# EAGLE design relay (EAGLE 9.2.2)
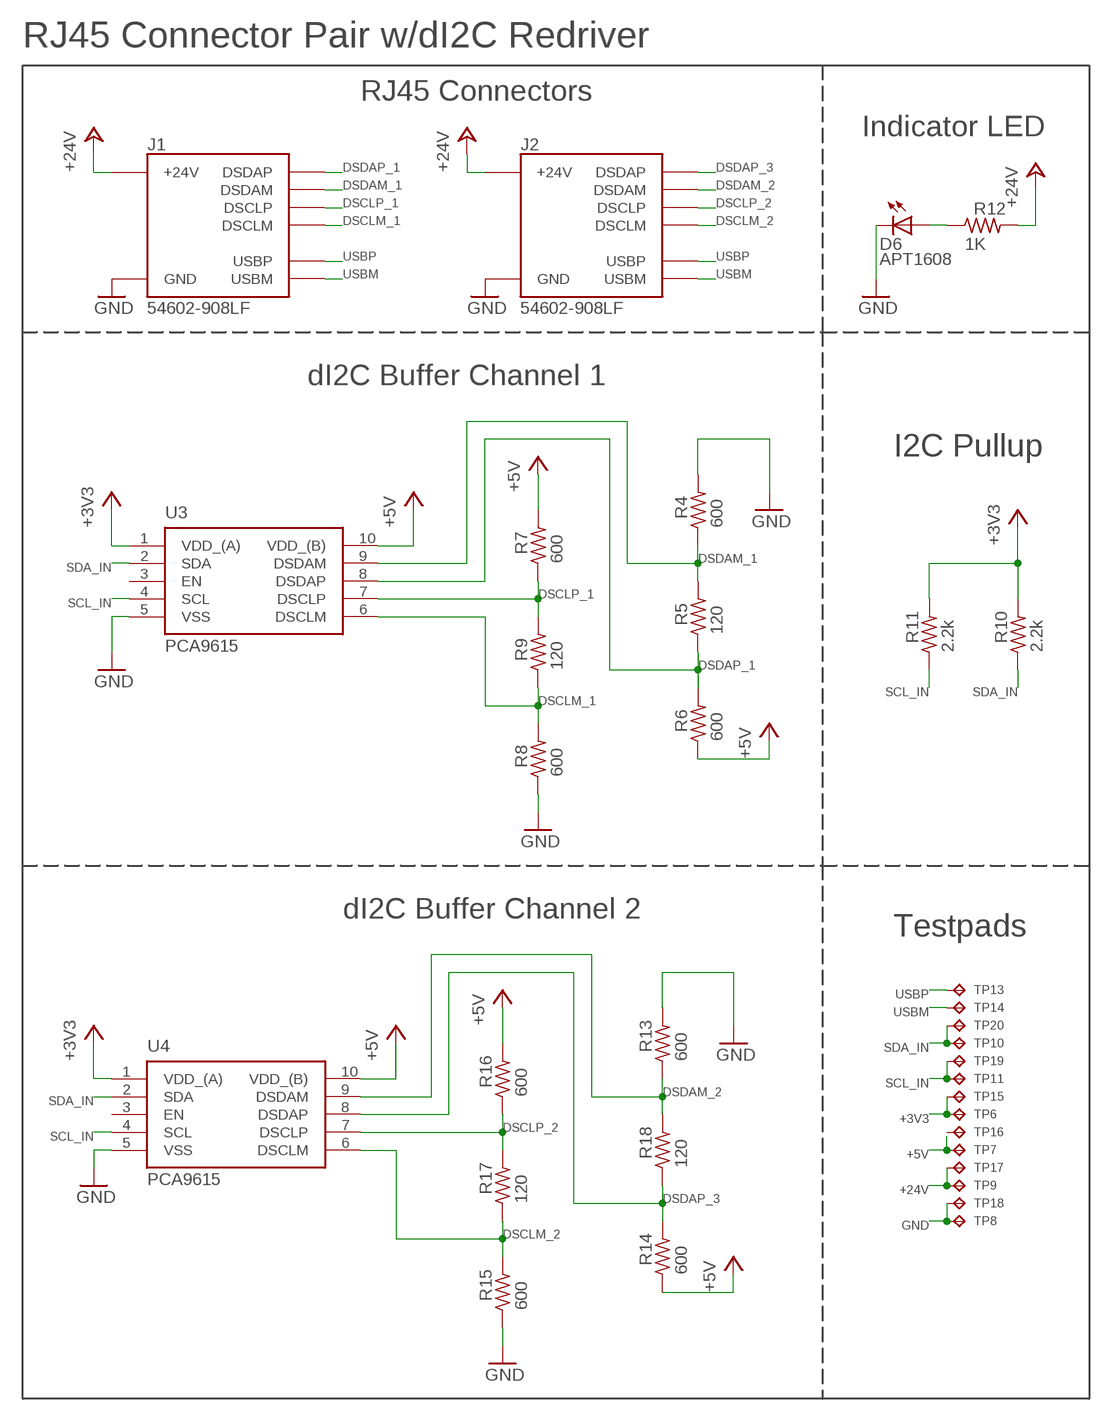
[diagram p0: schematic, sheet 1, part 1 of 2]
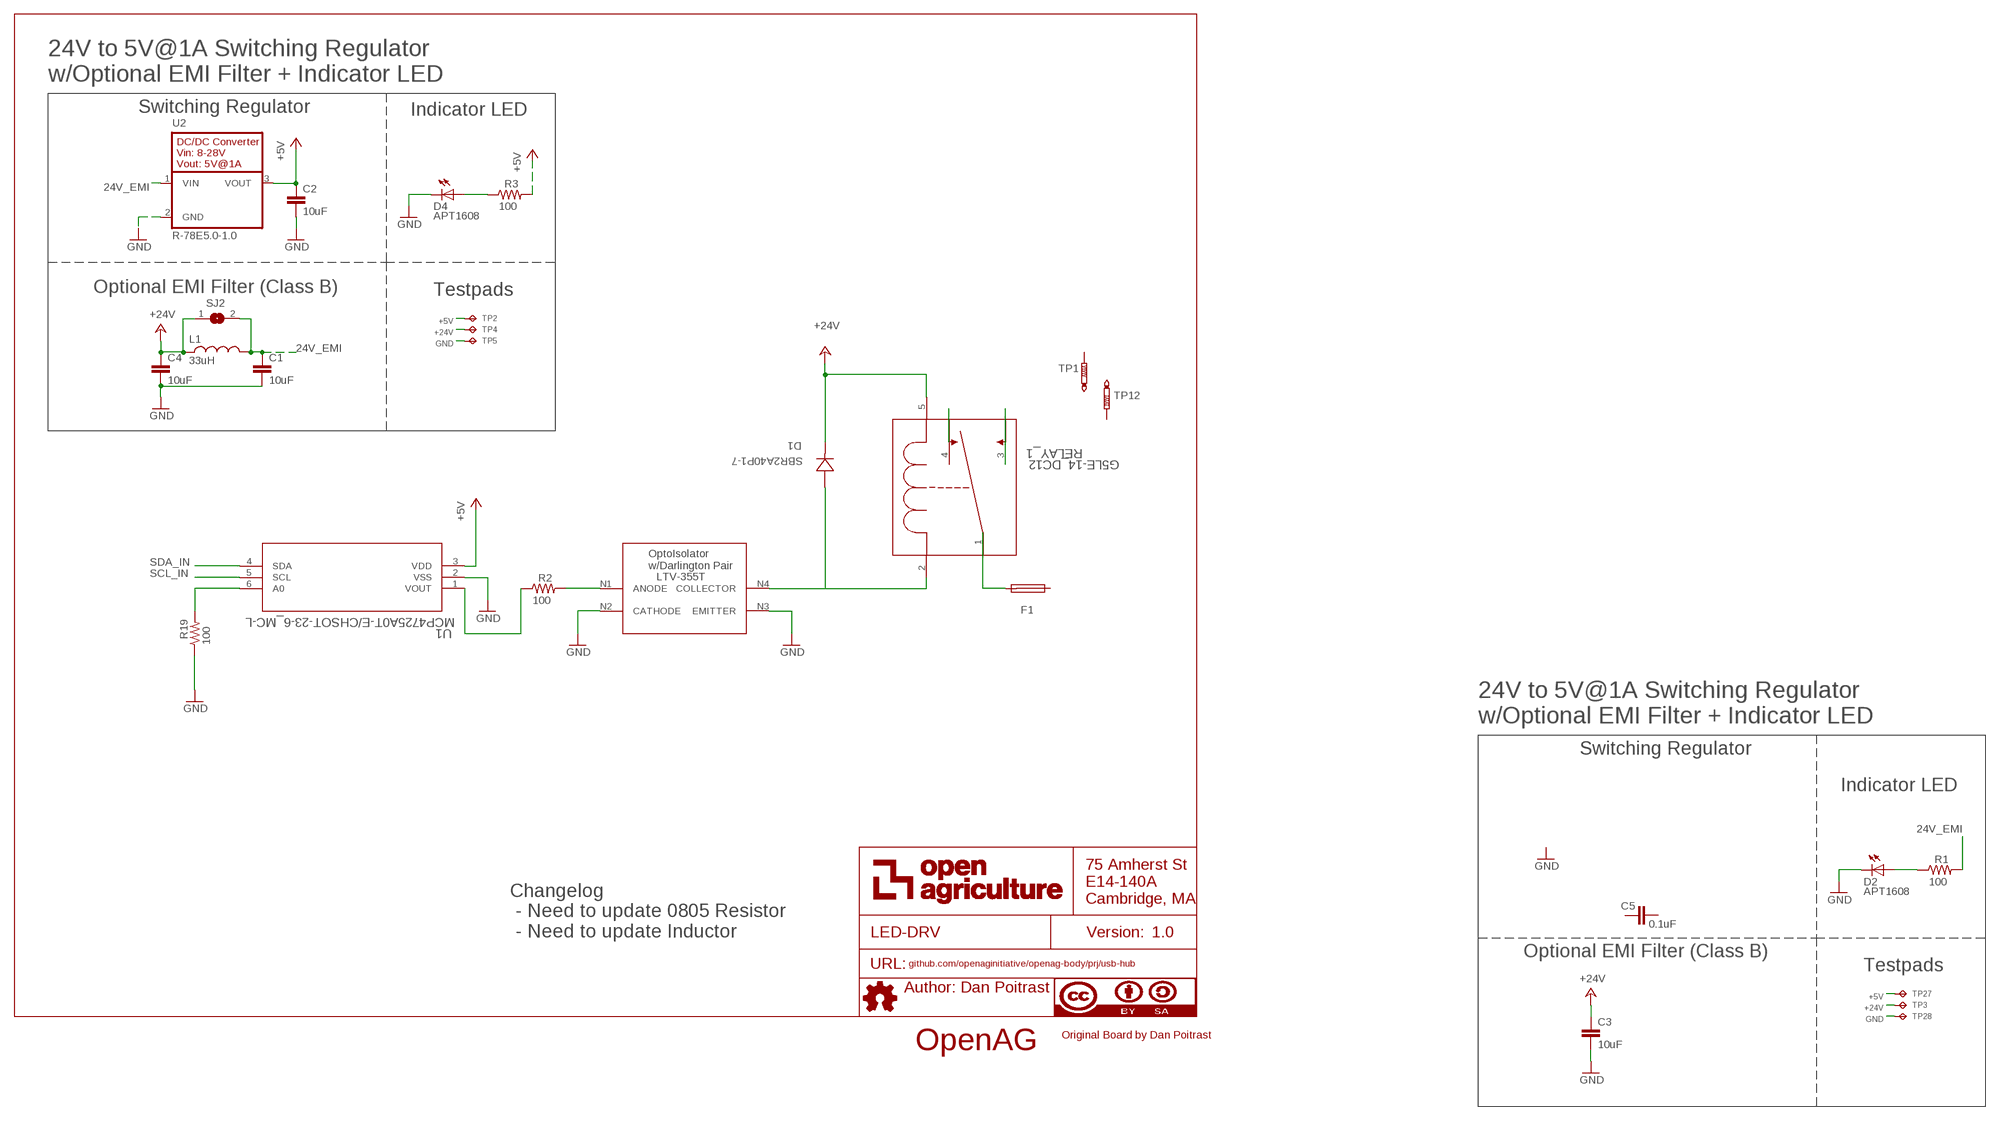
[diagram p1: schematic, sheet 1, part 2 of 2]

## Parts
C1  10uF  10UF-GMK212BBJ106KG-T  [C0805]
C2  10uF  10UF-GMK212BBJ106KG-T  [C0805]
C3  10uF  10UF-GMK212BBJ106KG-T  [C0805]
C4  10uF  10UF-GMK212BBJ106KG-T  [C0805]
C5  0.1uF  0.1UF-C0603C104K5RACTU  [C0603]
D1  SBR2A40P1-7  [POWERDI123]
D2  APT1608  APT1608CGCK  [CHIPLED_0603]
D4  APT1608  APT1608CGCK  [CHIPLED_0603]
D6  APT1608  APT1608CGCK  [CHIPLED_0603]
F1  GSH15  [GSH15]
J1  54602-908LF  RJ45-DI2C-USB-54602-908LFPTH  [RJ45-DI2C-USB-54602-908LF]
J2  54602-908LF  RJ45-DI2C-USB-54602-908LFPTH  [RJ45-DI2C-USB-54602-908LF]
L1  33uH  33UH-29333C  [29333C]
R1  100  100OHM-RC0603JR-07100RL  [RC0603N]
R2  100  100OHM-RC0603JR-07100RL  [RC0603N]
R3  100  100OHM-RC0603JR-07100RL  [RC0603N]
R4  600  600OHM-RC0603FR-07604RL  [RC0603N]
R5  120  120OHM-RC0603FR-07120RL  [RC0603N]
R6  600  600OHM-RC0603FR-07604RL  [RC0603N]
R7  600  600OHM-RC0603FR-07604RL  [RC0603N]
R8  600  600OHM-RC0603FR-07604RL  [RC0603N]
R9  120  120OHM-RC0603FR-07120RL  [RC0603N]
R10  2.2k  2.2K-RC0603JR-072K2L  [RC0603N]
R11  2.2k  2.2K-RC0603JR-072K2L  [RC0603N]
R12  1K  1K-ERJ-PB3D1001V  [RC0603N]
R13  600  600OHM-RC0603FR-07604RL  [RC0603N]
R14  600  600OHM-RC0603FR-07604RL  [RC0603N]
R15  600  600OHM-RC0603FR-07604RL  [RC0603N]
R16  600  600OHM-RC0603FR-07604RL  [RC0603N]
R17  120  120OHM-RC0603FR-07120RL  [RC0603N]
R18  120  120OHM-RC0603FR-07120RL  [RC0603N]
R19  100  100OHM-RC0603JR-07100RL  [RC0603N]
RELAY_1  G5LE-14_DC12  [RELAY_G5LE-1]
SJ2  EMI-BYPASS  [EMI-BYPASS]
TP1  PTR1B2,54  [B2,54]
TP2  TPTP06R  [TP06R]
TP3  TPTP06R  [TP06R]
TP4  TPTP06R  [TP06R]
TP5  TPTP06R  [TP06R]
TP6  TPTP04R  [TP04R]
TP7  TPTP04R  [TP04R]
TP8  TPTP04R  [TP04R]
TP9  TPTP04R  [TP04R]
TP10  TPTP04R  [TP04R]
TP11  TPTP04R  [TP04R]
TP12  PTR1B2,54  [B2,54]
TP13  TPTP04R  [TP04R]
TP14  TPTP04R  [TP04R]
TP15  TPTP04R  [TP04R]
TP16  TPTP04R  [TP04R]
TP17  TPTP04R  [TP04R]
TP18  TPTP04R  [TP04R]
TP19  TPTP04R  [TP04R]
TP20  TPTP04R  [TP04R]
TP27  TPTP06R  [TP06R]
TP28  TPTP06R  [TP06R]
U1  MCP4725A0T-E/CHSOT-23-6_MC-L  [SOT-23-6_MC-L]
U2  R-78E5.0-1.0  [R-78E5.0-1.0]
U3  PCA9615  PCA9615DPJ  [SOP50P490X110-10N]
U4  PCA9615  PCA9615DPJ  [SOP50P490X110-10N]
U$6  AUTHOR  [AUTHOR]
U$7  TITLE  [TITLE]
U$9  LTV-355T  [LTV-355T]

## Nets
24V_EMI: C1.1 L1.2 R1.2 SJ2.2 U2.1(VIN)
+3V3: R10.2 R11.2 TP6.1(TP) TP15.1(TP) U3.1(VDD_(A)) U4.1(VDD_(A))
+5V: C2.1 R3.2 R6.1 R7.2 R14.1 R16.2 TP2.TP TP7.1(TP) TP16.1(TP) TP27.TP U1.3(VDD) U2.3(VOUT) U3.10(VDD_(B)) U4.10(VDD_(B))
+24V: C3.1 C4.1 D1.- J1.24V(6)(+24V) J2.24V(6)(+24V) L1.1 R12.2 RELAY_1.5 SJ2.1 TP3.TP TP4.TP TP9.1(TP) TP17.1(TP)
DSCLM_1: J1.DSCLM(5)(DSCLM) R8.2 R9.1 U3.6(DSCLM)
DSCLM_2: J2.DSCLM(5)(DSCLM) R15.2 R17.1 U4.6(DSCLM)
DSCLP_1: J1.DSCLP(4)(DSCLP) R7.1 R9.2 U3.7(DSCLP)
DSCLP_2: J2.DSCLP(4)(DSCLP) R16.1 R17.2 U4.7(DSCLP)
DSDAM_1: J1.DSDAM(2)(DSDAM) R4.1 R5.2 U3.9(DSDAM)
DSDAM_2: J2.DSDAM(2)(DSDAM) R13.1 R18.2 U4.9(DSDAM)
DSDAP_1: J1.DSDAP(1)(DSDAP) R5.1 R6.2 U3.8(DSDAP)
DSDAP_3: J2.DSDAP(1)(DSDAP) R14.2 R18.1 U4.8(DSDAP)
GND: C1.2 C2.2 C3.2 C4.2 D2.C D4.C D6.C R4.2 R8.1 R13.2 R15.1 R19.1 TP5.TP TP8.1(TP) TP18.1(TP) TP28.TP U1.2(VSS) U2.2(GND) U3.5(VSS) U4.5(VSS) U$9.N2(CATHODE) U$9.N3(EMITTER)
N$4: RELAY_1.3
N$5: D1.+ RELAY_1.2 U$9.N4(COLLECTOR)
N$6: D2.A R1.1
N$11: F1.2 RELAY_1.1
N$27: R2.2 U$9.N1(ANODE)
N$31: R2.1 U1.1(VOUT)
N$32: R19.2 U1.6(A0)
N$33: D4.A R3.1
N$43: D6.A R12.1
SCL_IN: R11.1 TP11.1(TP) TP19.1(TP) U1.5(SCL) U3.4(SCL) U4.4(SCL)
SDA_IN: R10.1 TP10.1(TP) TP20.1(TP) U1.4(SDA) U3.2(SDA) U4.2(SDA)
USBM: J1.USBM(8)(USBM) J2.USBM(8)(USBM) TP14.1(TP)
USBP: J1.USBP(7)(USBP) J2.USBP(7)(USBP) TP13.1(TP)
Unconnected: C5.1 C5.2 F1.1 J1.GND(3)(GND) J2.GND(3)(GND) RELAY_1.4 TP1.TP TP12.TP U3.3(EN) U4.3(EN)

## Notes on the sheet
- 24V to 5V@1A Switching Regulator
  w/Optional EMI Filter + Indicator LED
- RJ45 Connector Pair w/dI2C Redriver
- Switching Regulator | Indicator LED
- RJ45 Connectors
- Indicator LED
- Optional EMI Filter (Class B) | Testpads
- dI2C Buffer Channel 1
- I2C Pullup
- LTV-355T
- dI2C Buffer Channel 2
- Testpads
- 24V to 5V@1A Switching Regulator
  w/Optional EMI Filter + Indicator LED
- Switching Regulator
- Indicator LED
- Changelog
   - Need to update 0805 Resistor
   - Need to update Inductor
- Optional EMI Filter (Class B)
- Testpads
- Original Board by Dan Poitrast
- OpenAG

## Library data of the parts
C1-C4 = openag-capacitors:10UF-GMK212BBJ106KG-T: CAP CER 10UF 35V X5R 0805 Description: 10µF ±10% 35V Ceramic Capacitor X5R 0805 (2012 Metric) Technical Specifications: Capacitance: 10µF Tolerance: ±10% Rated Voltage: 35V Temperature Coefficient: X5R Operating Temperature: -55°C ~ 85°C Package / Case: 0805 (2012 Metric) Datasheet(s): GMK212BBJ106KG-T Spec <http://ds.yuden.co.jp/TYCOMPAS/ut/detail.do?productNo=GMK212BBJ106KG-T&fileName=GMK212BBJ106KG-T_SS&mode=specSheetDownload> Vendor(s): Digikey: 587-4893-1-ND <https://www.digikey.com/product-detail/en/taiyo-yuden/GMK212BBJ106KG-T/587-4893-1-ND/6563736>; MANUFACTURER: Taiyo Yuden; MPN: GMK212BBJ106KG-T; VENDOR: Digikey; VLINK: https://www.digikey.com/product-detail/en/taiyo-yuden/GMK212BBJ106KG-T/587-4893-1-ND/6563736; VPN: 587-4893-1-ND
C5 = openag-capacitors:0.1UF-C0603C104K5RACTU: CAP CER 0.1UF 50V X7R 0603 Description: 0.1µF ±10% 50V Ceramic Capacitor X7R 0603 (1608 Metric) Technical Specifications: Capacitance: 0.1µF Tolerance: ±10% Rated Voltage: 50V Temperature Coefficient: X7R Operating Temperature: -55°C ~ 125°C Package / Case: 0603 (1608 Metric) Datasheet(s): X7R Dielectric, 6.3-250 VDC <https://search.kemet.com/component-edge/download/datasheet/C0603C104K5RACTU.pdf> Vendor(s): Digikey: 399-5089-1-ND <https://www.digikey.com/product-detail/en/kemet/C0603C104K5RACTU/399-5089-1-ND/1465623>; MANUFACTURER: Kemet; MPN: C0603C104K5RACTU; VENDOR: Digikey; VLINK: https://www.digikey.com/product-detail/en/kemet/C0603C104K5RACTU/399-5089-1-ND/1465623; VPN: 399-5089-1-ND
D1 = openag-diodes:SBR2A40P1-7: DIODE SBR 40V 2A POWERDI123 Description: Diode Super Barrier 40V 2A Surface Mount PowerDI™ 123 Technical Specifications: Diode Type: Super Barrier Voltage - DC Reverse (Vr) (Max): 40V Current - Average Rectified (Io): 2A Voltage - Forward (Vf) (Max) @ If: 500mV @ 2A Speed: Standard Recovery >500ns, > 200mA (Io) Current - Reverse Leakage @ Vr: 100µA @ 40V Mounting Type: Surface Mount Package / Case: POWERDI®123 Supplier Device Package: PowerDI™ 123 Operating Temperature - Junction: -65°C ~ 150°C Base Part Number: SBR2A40 Datasheet(s): SBR2A40P1 <https://www.diodes.com/assets/Datasheets/SBR2A40P1.pdf> Vendor(s): Digikey: SBR2A40P1DITR-ND <https://www.digikey.com/product-detail/en/diodes-incorporated/SBR2A40P1-7/SBR2A40P1DITR-ND/1681825>; MANUFACTURER: Diodes Incorporated; MPN: SBR2A40P1-7; VENDOR: Digikey; VLINK: https://www.digikey.com/product-detail/en/diodes-incorporated/SBR2A40P1-7/SBR2A40P1DITR-ND/1681825; VPN: SBR2A40P1DITR-ND
D2 D4 D6 = openag-diodes:APT1608CGCK: LED GREEN CLEAR 0603 SMD Description: Green 570nm LED Indication - Discrete 2.1V 0603 (1608 Metric) Technical Specifications: Color: Green Lens Color: Colorless Lens Transparency: Clear Millicandela Rating: 50mcd Lens Style/Size: Rectangle with Flat Top, 1.20mm x 0.80mm Voltage - Forward (Vf) (Typ): 2.1V Current - Test: 20mA Viewing Angle: 120° Mounting Type: Surface Mount Wavelength - Dominant: 570nm Wavelength - Peak: 574nm Package / Case: 0603 (1608 Metric) Supplier Device Package: Chip LED Size / Dimension: 1.60mm L x 0.80mm W Height (Max): 0.75mm Datasheet(s): APT1608CGCK <http://www.kingbrightusa.com/images/catalog/SPEC/APT1608CGCK.pdf> Vendor(s): Digikey: 754-1116-1-ND <https://www.digikey.com/product-detail/en/kingbright/APT1608CGCK/754-1116-1-ND/1747833#>; MANUFACTURER: Kingbright; MPN: APT1608CGCK; VENDOR: Digikey; VLINK: https://www.digikey.com/product-detail/en/kingbright/APT1608CGCK/754-1116-1-ND/1747833#; VPN: 754-1116-1-ND
F1 = fuse:GSH15: FUSE HOLDER grid 15mm, 19649 Wickmann; MPN: 64900001039; OC_FARNELL: 1271673; OC_NEWARK: 02P0318
J1 J2 = openag-connectors:RJ45-DI2C-USB-54602-908LF: CONN MOD JACK 8P8C R/A UNSHLD Description: Jack Modular Connector 8p8c (RJ45, Ethernet) 90° Angle (Right) Unshielded Cat3 Technical Specifications: Connector Type: Jack Number of Positions/Contacts: 8p8c (RJ45, Ethernet) Number of Ports: 1 Number of Rows: 1 Mounting Type: Through Hole Orientation: 90° Angle (Right) Termination: Solder Shielding: Unshielded Ratings: Cat3 Features: Board Lock LED Color: Does Not Contain LED Tab Direction: Down Contact Material: Copper Alloy Contact Finish: Gold Contact Finish Thickness: 15µin (0.38µm) Housing Material: Polyester, Glass Filled Operating Temperature: -40°C ~ 70°C Datasheet(s): 54601-x04(zzz)WPLF Drawing <http://cdn.amphenol-icc.com/media/wysiwyg/files/drawing/c-bmj-0102.pdf> Vendor(s): Digikey: 609-1046-ND <https://www.digikey.com/product-detail/en/amphenol-fci/54602-908LF/609-1046-ND/1001360>; MANUFACTURER: Amphenol FCI; MPN: 54602-908LF; VENDOR: Digikey; VLINK: https://www.digikey.com/product-detail/en/amphenol-fci/54602-908LF/609-1046-ND/1001360; VPN: 609-1046-ND
L1 = openag-inductors:33UH-29333C: FIXED IND 33UH 1A 120 MOHM SMD Description: 33µH Shielded Wirewound Inductor 1A 120 mOhm Max Nonstandard Technical Specifications: Type: Wirewound Inductance: 33µH Current Rating: 1A Shielding: Shielded DC Resistance (DCR): 120 mOhm Max Operating Temperature: -40°C ~ 85°C Frequency - Test: 10kHz Mounting Type: Surface Mount Package / Case: Nonstandard Size / Dimension: 0.283" L x 0.283" W (7.20mm x 7.20mm) Height - Seated (Max): 0.157" (4.00mm) Datasheet(s): 2900 Series <https://www.murata-ps.com/data/magnetics/kmp_2900.pdf> Vendor(s): Digikey: 811-1138-1-ND <https://www.digikey.com/product-detail/en/murata-power-solutions-inc/29333C/811-1138-1-ND/1924860>; MANUFACTURER: Murata Power Solutions Inc.; MPN: 29333C; VENDOR: Digikey; VLINK: https://www.digikey.com/product-detail/en/murata-power-solutions-inc/29333C/811-1138-1-ND/1924860; VPN: 811-1138-1-ND
R1-R3 R19 = openag-resistors:100OHM-RC0603JR-07100RL: RES SMD 100 OHM 5% 1/10W 0603 Description: 100 Ohms ±5% 0.1W, 1/10W Chip Resistor 0603 (1608 Metric) Moisture Resistant Thick Film Technical Specifications: Resistance: 100 Ohms Tolerance: ±5% Power (Watts): 0.1W, 1/10W Composition: Thick Film Features: Moisture Resistant Temperature Coefficient: ±100ppm/°C Operating Temperature: -55°C ~ 155°C Package / Case: 0603 (1608 Metric) Supplier Device Package: 0603 Size / Dimension: 0.063" L x 0.032" W (1.60mm x 0.80mm) Height - Seated (Max): 0.022" (0.55mm) Number of Terminations: 2 Datasheet(s): Thick Film Chip Resistor Intro <http://www.yageo.com.tw/exep/pages/download/literatures/PYu-R_INT-thick_7.pdf> Chip Resistor Marking <http://www.yageo.com/exep/pages/download/literatures/PYu-R_Marking_2.pdf> RC Series, L Datasheet <http://www.yageo.com/documents/recent/PYu-RC_Group_51_RoHS_L_8.pdf> Vendor(s): Digikey: 311-100GRCT-ND <https://www.digikey.com/product-detail/en/yageo/RC0603JR-07100RL/311-100GRCT-ND/729644>; MANUFACTURER: Yageo; MPN: RC0603JR-07100RL; VENDOR: Digikey; VLINK: https://www.digikey.com/product-detail/en/yageo/RC0603JR-07100RL/311-100GRCT-ND/729644; VPN: 311-100GRCT-ND
R4 R6-R8 R13-R16 = openag-resistors:600OHM-RC0603FR-07604RL: RES SMD 604 OHM 1% 1/10W 0603 Description: 604 Ohms ±1% 0.1W, 1/10W Chip Resistor 0603 (1608 Metric) Moisture Resistant Thick Film Technical Specifications: Resistance: 604 Ohms Tolerance: ±1% Power (Watts): 0.1W, 1/10W Composition: Thick Film Features: Moisture Resistant Temperature Coefficient: ±100ppm/°C Operating Temperature: -55°C ~ 155°C Package / Case: 0603 (1608 Metric) Supplier Device Package: 0603 Size / Dimension: 0.063" L x 0.032" W (1.60mm x 0.80mm) Height - Seated (Max): 0.022" (0.55mm) Number of Terminations: 2 Datasheet(s): RC Series, L Datasheet <http://www.yageo.com/documents/recent/PYu-RC_Group_51_RoHS_L_8.pdf> Chip Resistor Marking <http://www.yageo.com/exep/pages/download/literatures/PYu-R_Marking_2.pdf> Vendor(s): Digikey: 311-604HRCT-ND <https://www.digikey.com/product-detail/en/yageo/RC0603FR-07604RL/311-604HRCT-ND/730276>; MANUFACTURER: Yageo; MPN: RC0603FR-07604RL; VENDOR: Digikey; VLINK: https://www.digikey.com/product-detail/en/yageo/RC0603FR-07604RL/311-604HRCT-ND/730276; VPN: 311-604HRCT-ND
R5 R9 R17 R18 = openag-resistors:120OHM-RC0603FR-07120RL: RES SMD 120 OHM 1% 1/10W 0603 Description: 120 Ohms ±1% 0.1W, 1/10W Chip Resistor 0603 (1608 Metric) Moisture Resistant Thick Film Technical Specifications: Resistance: 120 Ohms Tolerance: ±1% Power (Watts): 0.1W, 1/10W Composition: Thick Film Features: Moisture Resistant Temperature Coefficient: ±100ppm/°C Operating Temperature: -55°C ~ 155°C Package / Case: 0603 (1608 Metric) Supplier Device Package: 0603 Size / Dimension: 0.063" L x 0.032" W (1.60mm x 0.80mm) Height - Seated (Max): 0.022" (0.55mm) Number of Terminations: 2 Datasheet(s): RC Series, L Datasheet <http://www.yageo.com/documents/recent/PYu-RC_Group_51_RoHS_L_8.pdf> Chip Resistor Marking <http://www.yageo.com/exep/pages/download/literatures/PYu-R_Marking_2.pdf> Vendor(s): Digikey: 311-120HRCT-ND <https://www.digikey.com/product-detail/en/yageo/RC0603FR-07120RL/311-120HRCT-ND/729867>; MANUFACTURER: Yageo; MPN: RC0603FR-07120RL; VENDOR: Digikey; VLINK: https://www.digikey.com/product-detail/en/yageo/RC0603FR-07120RL/311-120HRCT-ND/729867; VPN: 311-120HRCT-ND
R10 R11 = openag-resistors:2.2K-RC0603JR-072K2L: RES SMD 2.2K OHM 5% 1/10W 0603 Description: 2.2 kOhms ±5% 0.1W, 1/10W Chip Resistor 0603 (1608 Metric) Moisture Resistant Thick Film Technical Specifications: Resistance: 2.2 kOhms Tolerance: ±5% Power (Watts): 0.1W, 1/10W Composition: Thick Film Features: Moisture Resistant Temperature Coefficient: ±100ppm/°C Operating Temperature: -55°C ~ 155°C Package / Case: 0603 (1608 Metric) Supplier Device Package: 0603 Size / Dimension: 0.063" L x 0.032" W (1.60mm x 0.80mm) Height - Seated (Max): 0.022" (0.55mm) Number of Terminations: 2 Datasheet(s): RC Series, L Datasheet <http://www.yageo.com/documents/recent/PYu-RC_Group_51_RoHS_L_8.pdf> Chip Resistor Marking <http://www.yageo.com/exep/pages/download/literatures/PYu-R_Marking_2.pdf> Vendor(s): Digikey: 311-2.2KGRCT-ND <https://www.digikey.com/product-detail/en/yageo/RC0603JR-072K2L/311-2.2KGRCT-ND/729676#>; MANUFACTURER: Yageo; MPN: RC0603JR-072K2L; VENDOR: Digikey; VLINK: https://www.digikey.com/product-detail/en/yageo/RC0603JR-072K2L/311-2.2KGRCT-ND/729676#; VPN: 311-2.2KGRCT-ND
R12 = openag-resistors:1K-ERJ-PB3D1001V: RES SMD 1K OHM 0.5% 1/5W 0603 Description: 1 kOhms ±0.5% 0.2W, 1/5W Chip Resistor 0603 (1608 Metric) Automotive AEC-Q200, Pulse Withstanding Thick Film Technical Specifications: Resistance: 1 kOhms Tolerance: ±0.5% Power: 0.2W, 1/5W Operating Temperature: -55°C ~ 155°C Package / Case: 0603 (1608 Metric) Datasheet(s): ERJ-PB3, PB6 Series, High Precision Datasheet <https://industrial.panasonic.com/cdbs/www-data/pdf/RDM0000/AOA0000C328.pdf> Vendor(s): Digikey: P20283CT-ND <https://www.digikey.com/product-detail/en/panasonic-electronic-components/ERJ-PB3D1001V/P20283CT-ND/6214538>; MANUFACTURER: Panasonic; MPN: P20283CT-ND; VENDOR: Digikey; VLINK: https://www.digikey.com/product-detail/en/panasonic-electronic-components/ERJ-PB3D1001V/P20283CT-ND/6214538; VPN: P20283CT-ND
RELAY_1 = relay_2:G5LE-14_DC12; MANUFACTURER_PART_NUMBER: G5LE14 DC12; VENDOR: OMRON
SJ2 = openag-connectors:EMI-BYPASS: EMI Bypass Solder Jumper; MPN: N/A
TP1 TP12 = testpad:PTR1: TEST PIN
TP2-TP11 TP13-TP20 TP27 TP28 = openag-testpads:TP: Test pad; MPN: N/A
U1 = openag-dacs:MCP4725A0T-E/CH; MANUFACTURER_PART_NUMBER: MCP4725A0TECH; VENDOR: Microchip
U2 = openag-regulators:R-78E5.0-1.0: DC/DC CONVERTER 5V 5W Description: Linear Regulator Replacement DC DC Converter 1 Output 5V 1A 8V - 28V Input Technical Specifications: Type: Linear Regulator Replacement Number of Outputs: 1 Voltage - Input (Min): 8V Voltage - Input (Max): 28V Voltage - Output 1: 5V Current - Output (Max): 1A Power (Watts): 5W Applications: ITE (Commercial) Features: SCP Operating Temperature: -40°C ~ 85°C Efficiency: 91% Mounting Type: Through Hole Package / Case: 3-SIP Module Size / Dimension: 0.46" L x 0.33" W x 0.41" H (11.6mm x 8.5mm x 10.4mm) Datasheet(s): R-78E-1.0 Series Datasheet <https://www.recom-power.com/pdf/Innoline/R-78Exx-1.0.pdf> Vendor(s): Digikey: 945-2201-ND <https://www.digikey.com/product-detail/en/recom-power/R-78E5.0-1.0/945-2201-ND/4930585>; MANUFACTURER: Recom Power; MPN: R-78E5.0-1.0; VENDOR: Digikey; VLINK: https://www.digikey.com/product-detail/en/recom-power/R-78E5.0-1.0/945-2201-ND/4930585; VPN: 945-2201-ND
U3 U4 = openag-buffers:PCA9615DPJ: IC REDRIVER I2C 2CH 10TSSOP Description: Buffer, ReDriver 2 Channel 400kHz 10-TSSOP Technical Specifications: Type: Buffer, ReDriver Applications: I²C Input: 2-Wire Bus Output: 2-Wire Bus Data Rate (Max): 400kHz Number of Channels: 2 Capacitance - Input: 7pF Voltage - Supply: 2.3 V ~ 5.5 V Current - Supply: 16µA Operating Temperature: -40°C ~ 85°C Package / Case: 10-TFSOP, 10-MSOP (0.118", 3.00mm Width) Supplier Device Package: 10-TSSOP Base Part Number: PCA9615 Datasheet(s): PCA9615DP <http://www.nxp.com/documents/data_sheet/PCA9615.pdf> Vendor(s): Digikey: 568-11484-1-ND <https://www.digikey.com/product-detail/en/nxp-usa-inc/PCA9615DPJ/568-11484-1-ND/4864508>; MANUFACTURER: NXP USA Inc.; MPN: PCA9615DPJ; VENDOR: Digikey; VLINK: https://www.digikey.com/product-detail/en/nxp-usa-inc/PCA9615DPJ/568-11484-1-ND/4864508; VPN: 568-11484-1-ND
U$6 = openag-frames:AUTHOR; AUTHOR: Dan Poitrast; MPN: N/A
U$7 = openag-frames:TITLE; MPN: N/A; TITLE: LED-DRV; URL: github.com/openaginitiative/openag-body/prj/usb-hub; VER: 1.0
U$9 = openag-transistors:LTV-355T

## Board
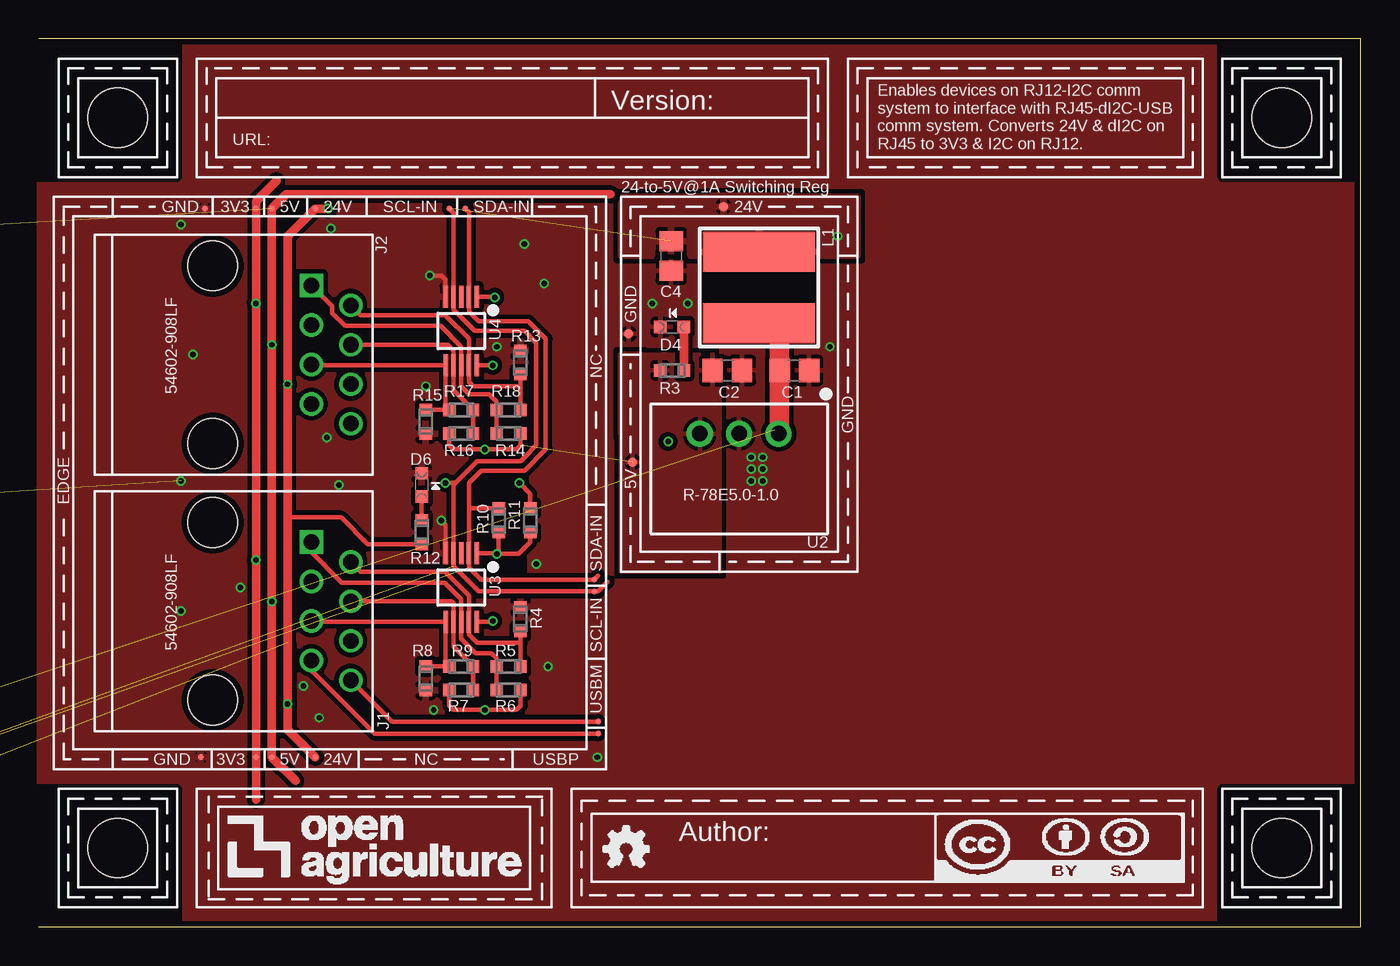
[diagram p2: board, top side]
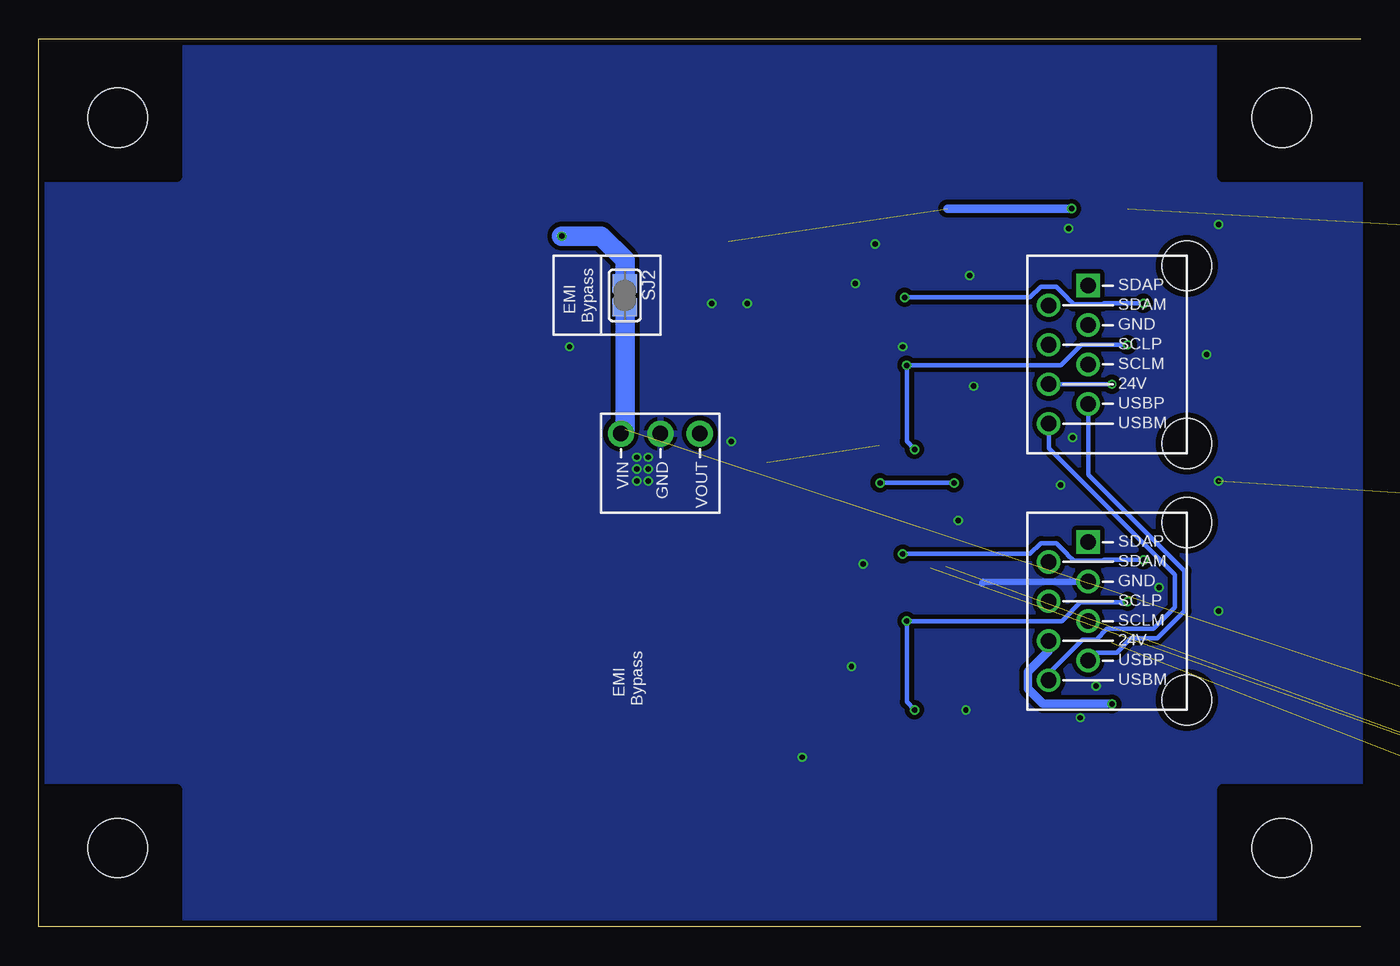
[diagram p3: board, bottom side, seen from below]

Size 85.09 x 57.15 mm. Coordinates in mm from the lower left corner, seen from the top.
Outline: 0,0 85.09,0 85.09,57.15 0,57.15
Copper layers (1*16): Top 0.035559375mm / dielectric 1.6mm / Bottom 0.035559375mm
Design rules "oshpark-2layer-mask": minimum track width 6mil, minimum drill 10mil, track to track 6mil, track to pad 6mil, pad to pad 6mil, via to via 6mil, smd to smd 6mil, copper to edge 15mil, drill to drill 6mil, minimum pad ring 5mil, minimum via ring 5mil, stop-mask expansion 2.5mil, vias tented up to drill 20mil, thermal gap 10mil
tRestrict: 3 lines

### Footprints (pad centres in the part's own frame; a part is rotated, then mirrored left to right if it is on the bottom)
C0805 = smd 1.3 x 1.5: 1 -0.95,0; 2 0.95,0
C0603 = smd 1.1 x 1: 1 -0.85,0; 2 0.85,0
POWERDI123 = smd 1.05 x 1.5: + -1.3,0 | smd 2.4 x 1.5: - 1.05,0
CHIPLED_0603 = smd 0.8 x 0.8: A 0,-0.75; C 0,0.75
GSH15 = drill 1.321 pad 2.54 long: 1 -7.62,0; 2 7.62,0 | hole 2.794: 0,0
RJ45-DI2C-USB-54602-908LF = drill 1: 24V(6) 1.905,8.89; DSCLM(5) 0.635,6.35; DSCLP(4) -0.635,8.89; DSDAM(2) -3.175,8.89; GND(3) -1.905,6.35; USBM(8) 4.445,8.89; USBP(7) 3.175,6.35 | drill 1 square: DSDAP(1) -4.445,6.35 | hole 3.2: -5.715,0; 5.715,0
29333C = smd 2.6 x 7.2: 1 -2.3,0; 2 2.3,0
RC0603N = smd 0.756 x 0.8: 1 -0.778,0; 2 0.778,0
RELAY_G5LE-1 = drill 1.524 pad 2.032 square: 1 0,17.424 | drill 1.524 pad 2.032: 2 -5.994,15.418; 3 -5.994,3.2; 4 5.994,3.2; 5 5.994,15.418
EMI-BYPASS = smd 1.168 x 1.6: 1 -0.762,0.254; 2 0.762,0.254
B2,54 = smd 2.54 x 2.54: TP 0,0
TP06R = smd 0.6 x 0.6: TP 0,0
TP04R = smd 0.4 x 0.4: 1 0,0
SOT-23-6_MC-L = smd 1.016 x 0.508: 1 -1.245,0.95; 2 -1.245,0; 3 -1.245,-0.95; 4 1.245,-0.95; 5 1.245,0; 6 1.245,0.95
R-78E5.0-1.0 = drill 1 pad 1.676: 1 -2.54,0; 2 0,0; 3 2.54,0
SOP50P490X110-10N = smd 1.4 x 0.3: 1 -2.2,1; 2 -2.2,0.5; 3 -2.2,0; 4 -2.2,-0.5; 5 -2.2,-1; 6 2.2,-1; 7 2.2,-0.5; 8 2.2,0; 9 2.2,0.5; 10 2.2,1
CORNER = hole 3.81: 0,0
LTV-355T = smd 0.8 x 1: N1 -1.27,-3.25; N2 1.27,-3.25; N3 -1.27,3.25; N4 1.27,3.25

### Placement (x,y rotation side)
C1  48.64,35.81 0 top
C2  44.32,35.81 0 top
C3  -40.01,-3.24 180 top  (outside the outline)
C4  40.7,43.18 270 top
C5  -37.78,6.67 180 top  (outside the outline)
D1  -40.32,-6.03 0 top  (outside the outline)
D2  -32.58,6.54 90 top  (outside the outline)
D4  40.77,38.61 90 top
D6  24.65,28.45 0 top
F1  -60.96,-19.68 90 top  (outside the outline)
J1  11.19,20.32 270 top
J2  11.19,36.83 270 top
L1  46.35,41.15 270 top
R1  -29.65,6.73 0 top  (outside the outline)
R2  -51.12,-1.59 0 top  (outside the outline)
R3  40.77,35.81 180 top
R4  31,19.81 90 top
R5  30.24,16.76 0 top
R6  30.24,15.24 180 top
R7  27.19,15.24 180 top
R8  24.9,16 90 top
R9  27.19,16.76 0 top
R10  29.6,26.16 270 top
R11  31.64,26.16 270 top
R12  24.65,25.4 270 top
R13  31,36.32 90 top
R14  30.24,31.75 180 top
R15  24.9,32.51 90 top
R16  27.19,31.75 180 top
R17  27.19,33.27 0 top
R18  30.24,33.27 0 top
R19  -53.02,-8.26 0 top  (outside the outline)
RELAY_1  -45.72,-29.21 0 top  (outside the outline)
SJ2  47.62,40.64 270 bottom
TP1  -64.45,16.19 0 top  (outside the outline)
TP2  38.23,29.91 180 top
TP3  -46.67,49.47 270 top  (outside the outline)
TP4  44.07,46.35 180 top
TP5  37.97,38.16 180 top
TP6  13.98,10.92 0 top
TP7  15,10.92 0 top
TP8  10.43,10.92 0 top
TP9  17.79,10.92 0 top
TP10  35.75,22.35 0 top
TP11  35.75,21.59 0 top
TP12  -69.53,15.88 0 top  (outside the outline)
TP13  36,12.45 0 top
TP14  36,13.21 0 top
TP15  13.98,46.23 0 top
TP16  15,46.23 0 top
TP17  17.79,46.23 0 top
TP18  10.68,46.23 0 top
TP19  26.43,46.23 0 top
TP20  27.44,46.23 0 top
TP27  -30.23,43.62 270 top  (outside the outline)
TP28  -38.48,43.37 270 top  (outside the outline)
U1  -53.34,-4.76 270 top  (outside the outline)
U2  45.09,31.75 180 top
U3  27.19,21.84 270 top
U4  27.19,38.35 270 top
U$1  [CORNER]  5.08,5.08 0 top
U$2  [CORNER]  5.08,52.07 270 top
U$3  [CORNER]  80.01,52.07 180 top
U$4  [CORNER]  80.01,5.08 90 top
U$5  [LOGO]  10.16,1.27 0 top
U$6  34.29,1.27 0 top
U$7  10.16,48.26 0 top
U$9  -46.99,-4.76 270 top  (outside the outline)

### Tracks (layer width: path | path; a pad name or v marks a point on that pad's centre or on a via)
24V_EMI  (1 unrouted)
  Top 1.27: U2.1 47.69,31.82 C1.1 47.69,37.51 arc90 L1.2
  Bottom 1.27: SJ2.2 47.37,32 U2.1
+3V3  (via drill 0.35)
  Top 0.305: v29.48,24 29.6,24.13 R10.2 | v29.35,40.51 29.31,40.55 U4.1 | v29.48,24 30.87,24 31.64,24.77 R11.2 | U3.1 29.44,24.04 v29.48,24
  Top 0.559: 15.3,48.01 13.98,46.69 TP15.1 v13.98,40.13 v13.98,23.62 TP6.1 13.98,8.18
  Bottom 0.305: v29.48,24 21.28,24 20.58,24.7 19.58,24.7 18.87,24 18.87,23.95 18.48,23.56 16.6,23.56 16.54,23.62 v13.98,23.62 | v13.98,40.13 16.54,40.13 16.6,40.07 18.48,40.07 18.87,40.46 18.87,40.51 19.58,41.21 20.58,41.21 21.28,40.51 v29.35,40.51
+5V  (via drill 0.35)  (3 unrouted)
  Top 0.305: v29.22,36.14 29.21,36.15 U4.10 | R16.2 26.41,31 26.68,30.73 v28.71,30.73 30.75,30.73 31.02,31 R14.1 | v29.22,19.68 29.18,19.64 U3.10 | R7.2 26.41,14.24 26.68,13.97 v28.71,13.97 30.75,13.97 31.02,14.24 R6.1
  Top 0.559: 36.82,47.14 15.91,47.14 TP16.1 v15,37.47 v15,20.95 TP7.1 16.52,9.4
  Bottom 0.305: v28.71,30.73 29.22,31.24 v29.22,36.14 19.3,36.14 17.98,37.47 v15,37.47 | v15,20.95 15.06,20.89 18.04,20.89 19.25,19.68 v29.22,19.68 29.22,14.48 v28.71,13.97
  pour Top (isolate 0.305): 37.47,22.86 37.47,36.83 43.81,36.83 43.81,22.86
  pour Top (isolate 0.406): 38.73,36.83 37.47,36.83 37.47,31.75 38.73,31.75
+24V  (via drill 0.35)  (5 unrouted)
  Top 0.305: 16.14,18.41 16.02,18.29 | 16.02,26.35 19.44,26.35 21.17,24.62 R12.2
  Top 0.559: TP9.1 16.02,12.7 v16.02,14.35 16.02,18.29 16.02,26.35 v16.02,34.92 16.02,44.45 TP17.1 v18.61,46.23
  Bottom 0.305: J2.24V(6) v16.02,34.92
  Bottom 0.559: v16.02,14.35 20.44,14.35 21.41,15.32 21.41,16.43 20.08,17.76 J1.24V(6) | v18.61,46.23 26.61,46.23
  Bottom 1.27: SJ2.1 47.37,42.93 48.9,44.45 v51.44,44.45
  pour Top (isolate 0.406): -43.5,42.86 -47.31,42.86 -47.31,58.1 -43.5,58.1
  pour Top (isolate 0.406): 37.47,43.18 37.47,46.99 52.7,46.99 52.7,43.18
  pour Top (isolate 0.406): 43.31,47.05 48.64,47.05 48.64,45.97 43.31,45.97
  pour Top (isolate 0.406): 51.44,46.99 52.7,43.18 51.44,43.18
DSCLM_1
  Top 0.305: 26.18,16.76 R9.1 26.32,16.8 26.19,16.92 U3.6 17.58,19.64 J1.DSCLM(5) | 26.18,16.76 24.92,16.76 R8.2 | 26.19,16.78 26.18,16.76
DSCLM_2
  Top 0.305: R15.2 24.92,33.27 R17.1 26.19,33.5 U4.6 17.58,36.15 J2.DSCLM(5)
DSCLP_1
  Top 0.305: R7.1 R9.2 26.69,18.04 U3.7 26.69,20.82 26.56,20.95 J1.DSCLP(4)
DSCLP_2
  Top 0.305: R16.1 R17.2 27.95,33.27 26.69,34.54 U4.7 26.69,37.08 26.3,37.47 J2.DSCLP(4)
DSDAM_1
  Top 0.305: R5.2 31.02,18.29 | 31.02,18.29 31.02,18.76 R4.1 | 31.02,18.29 28.21,18.29 27.69,18.8 U3.9 27.69,21.33 26.16,22.86 20.71,22.86 J1.DSDAM(2)
DSDAM_2
  Top 0.305: R13.1 31,34.8 | 31,34.8 27.95,34.8 27.69,35.06 U4.9 27.69,37.84 | 31,34.8 31,33.29 R18.2 | 27.69,37.84 27.7,37.85 | 27.69,37.84 26.16,39.37 20.71,39.37 J2.DSDAM(2)
DSDAP_1
  Top 0.305: R5.1 R6.2 | 29.39,16.76 R5.1 | R5.1 29.46,17.29 29.13,17.62 28.11,17.62 27.19,18.54 U3.8 27.19,21.08 26.11,22.16 19.51,22.16 17.54,24.13 J1.DSDAP(1)
DSDAP_3
  Top 0.305: R14.2 R18.1 29.46,33.8 28.97,34.29 27.7,34.29 27.19,34.8 U4.8 27.19,37.34 25.86,38.67 19.7,38.67 18.87,39.51 18.87,39.94 J2.DSDAP(1)
GND  (via drill 0.35)  (16 unrouted)
  Top 0.305: U3.5 26.19,25.38 | 26.19,25.38 26.18,25.4 | 26.19,25.38 26.19,25.89 v25.92,26.16 | U4.5 26.19,41.64 25.92,41.91 v25.16,41.91
  Bottom 0.406: 17.54,22.23 24.27,22.23 24.4,22.1
  other vias: -24.7,24.26 -24.07,24.51 -24.7,24.89 -24.07,25.27 -24.07,25.91 -24.7,25.53 -24.7,26.16 -24.07,26.54 -24.7,26.8 40.51,31.24 41.78,40.13 50.93,37.34 45.85,30.23 45.85,29.46 46.61,29.46 46.61,30.23 45.85,28.7 46.61,28.7 39.5,40.13 9.16,20.32 32.78,16.76 9.16,28.7 9.92,36.83 19.32,28.45 9.16,45.21 29.48,37.34 25.41,13.97 31.25,43.94 32.52,41.4 32.02,23.37 17.03,15.49 18.55,31.5 12.97,21.84 18.05,13.46 24.9,34.8 18.81,44.96 35.95,10.92
  pour Top (isolate 0.305, rank 3): 0,0 85.09,0 85.09,57.15 0,57.15
  pour Bottom (isolate 0.305, rank 3): 0,0 85.09,0 85.09,57.15 0,57.15
  pour Top (isolate 0.305, rank 2): -18.1,42.86 -47.31,42.86 -47.31,58.1 -18.1,58.1
  pour Bottom (isolate 0.406, rank 2): -18.1,58.1 -47.31,58.1 -47.31,42.86 -18.1,42.86
  pour Top (isolate 0.305, rank 2): 37.47,22.86 37.47,46.99 52.7,46.99 52.7,22.86
  pour Bottom (isolate 0.406, rank 2): 52.7,22.86 52.7,46.99 37.47,46.99 37.47,22.86
  pour Top (isolate 0.305): 0.95,10.16 36.51,10.16 36.51,46.99 0.95,46.99
  pour Bottom (isolate 0.406): 36.51,10.16 36.51,46.99 0.95,46.99 0.95,10.16
N$5  (2 unrouted)
N$6  (1 unrouted)
N$11  (1 unrouted)
N$27  (1 unrouted)
N$31  (1 unrouted)
N$32  (1 unrouted)
N$33
  Top 0.559: R3.1 41.55,38.58 D4.A
N$43
  Top 0.305: R12.1 D6.A
SCL_IN  (via drill 0.35)  (1 unrouted)
  Top 0.305: 31.25,30.23 31,29.97 28.21,29.97 26.82,28.58 | 26.82,28.58 26.18,28.58 v26.18,28.57 | v30.94,28.57 31.64,27.88 R11.1 | 31.25,30.23 | 31.25,30.23 32.02,30.99 32.02,37.59 31.25,38.35 28.05,38.35 26.69,39.72 U4.4 26.69,45.97 TP19.1 | 26.82,28.58 26.69,28.45 U3.4 26.69,23.21 28.31,21.59 TP11.1 36.01,21.59 36.61,22.2
  Bottom 0.305: v26.18,28.57 v30.94,28.57
SDA_IN  (1 unrouted)
  Top 0.305: 27.69,26.92 27.69,28.59 28.46,29.36 31.25,29.36 32.63,30.73 32.63,37.84 31.51,38.96 28.3,38.96 27.69,39.58 U4.2 27.69,45.98 TP20.1 | R10.1 27.71,26.94 27.69,26.92 | 27.69,26.92 U3.2 27.69,23.12 28.46,22.35 TP10.1 36.01,22.61
USBM
  Top 0.305: J1.USBM(8) 22.75,13.21 TP14.1
  Bottom 0.305: J2.USBM(8) 20.08,30.79 11.95,22.67 11.95,20.57 13.35,19.17 16.33,19.17 17.03,18.48 17.91,18.48 20.08,16.31 J1.USBM(8)
USBP
  Top 0.305: TP13.1 21.6,12.45 17.54,16.51 J1.USBP(7)
  Bottom 0.305: J1.USBP(7) 17.03,17.66 15.7,17.66 14.79,18.57 13.1,18.57 11.34,20.32 11.34,22.92 17.54,29.11 J2.USBP(7)

### Text on the board
tPlace: GND | 24V | Enables devices on RJ12-I2C comm / system to interface with RJ45-dI2C-USB / comm system. Converts 24V & dI2C on / RJ45 to 3V3 & I2C on RJ12. | SCL-IN | 24-to-5V@1A Switching Reg | 24V | GND | 3V3 | 5V | 24V | SDA-IN | GND | 5V | 4.5-40V 1.5A LED Driver / w/Optional EMI Filter + Indicator LED | GND | NC | GND | 5V | EDGE | SDA-IN | SCL-IN | USBM | GND | 3V3 | 5V | 24V | NC | USBP
bPlace: EMI / Bypass